# EAGLE design MidiExpansion (EAGLE 9.6.2)
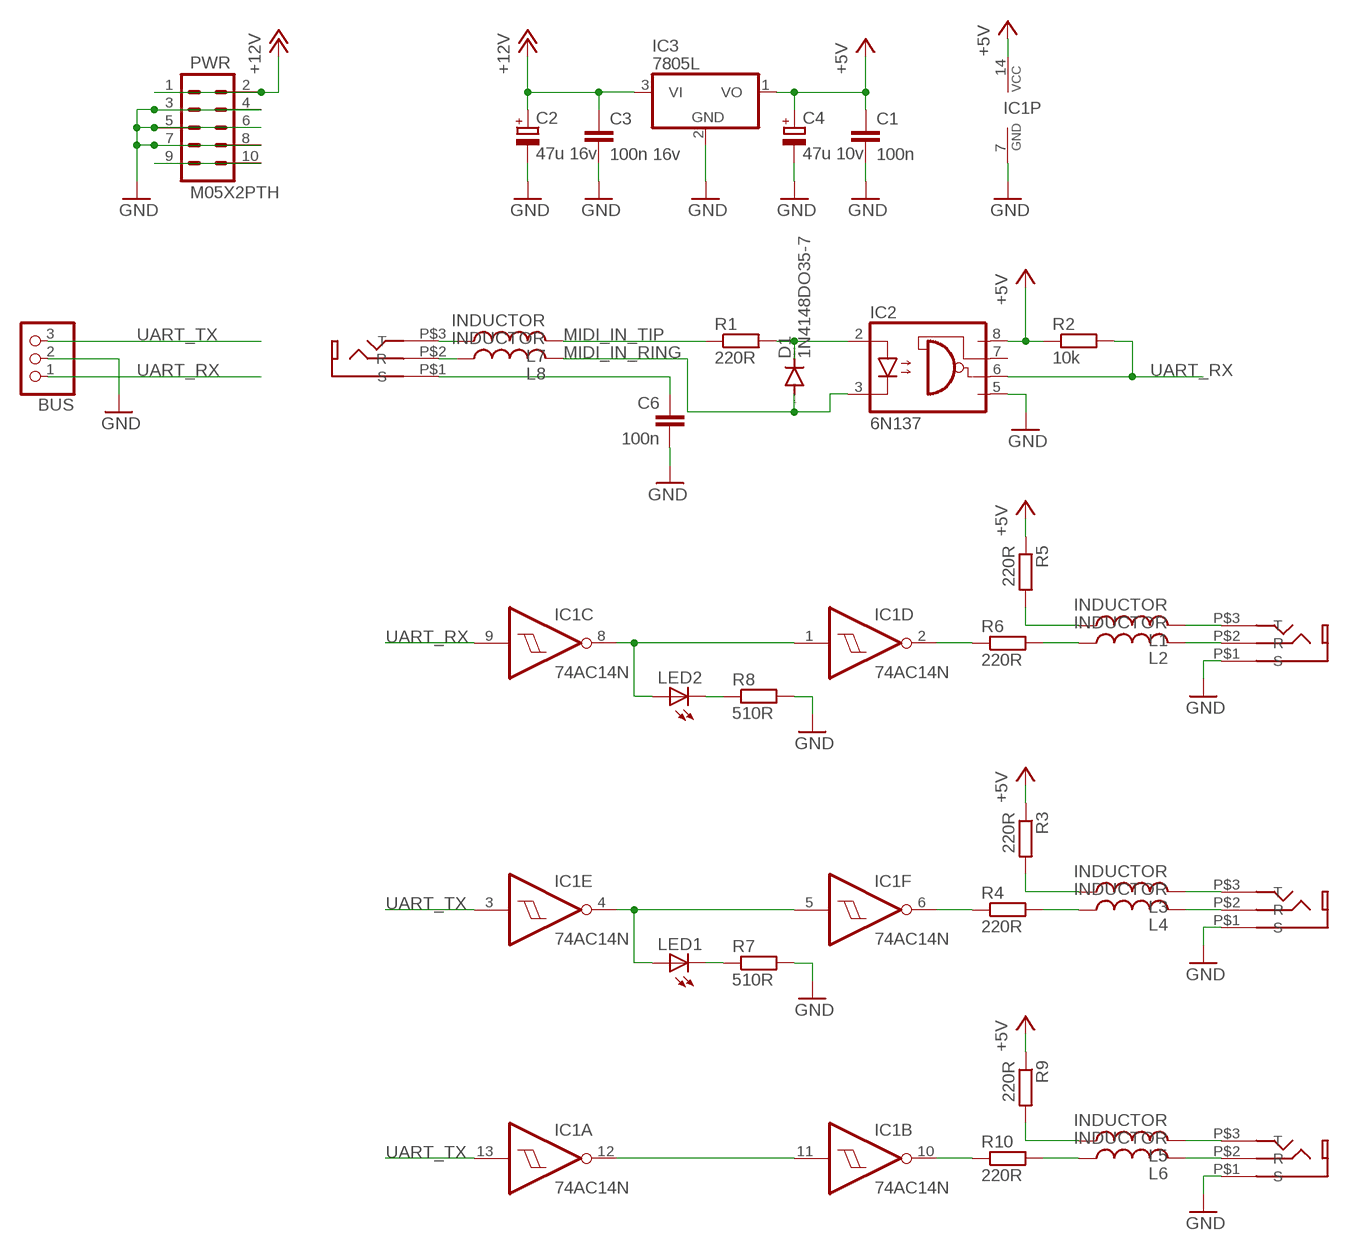
[diagram p0: schematic, sheet 1]

## Parts
BUS  CON-JST-1X03PH-TH  [JST-B3B-PH-KL]
C1  100n  C-EU050-024X044  [C050-024X044]
C2  47u 16v  CPOL-EUE5-6  [E5-6]
C3  100n 16v  C-EU050-024X044  [C050-024X044]
C4  47u 10v  CPOL-EUE5-6  [E5-6]
C6  100n  C-EU050-024X044  [C050-024X044]
D1  1N4148DO35-7  [DO35-7]
IC1  74AC14N  [DIL14]
IC2  6N137  [DIL08]
IC3  7805L  [TO92]
L1  INDUCTOR  [0603]
L2  INDUCTOR  [0603]
L3  INDUCTOR  [0603]
L4  INDUCTOR  [0603]
L5  INDUCTOR  [0603]
L6  INDUCTOR  [0603]
L7  INDUCTOR  [0603]
L8  INDUCTOR  [0603]
LED1  LED3MM  [LED3MM]
LED2  LED3MM  [LED3MM]
MIDI_IN  THONKICONN_STEREO  [THONKICONN_STEREO]
MIDI_OUT  THONKICONN_STEREO  [THONKICONN_STEREO]
MIDI_OUT1  THONKICONN_STEREO  [THONKICONN_STEREO]
MIDI_THRU  THONKICONN_STEREO  [THONKICONN_STEREO]
PWR  M05X2PTH  [AVR_ICSP]
R1  220R  R-EU_0204/7  [0204/7]
R2  10k  R-EU_0204/7  [0204/7]
R3  220R  R-EU_0204/7  [0204/7]
R4  220R  R-EU_0204/7  [0204/7]
R5  220R  R-EU_0204/7  [0204/7]
R6  220R  R-EU_0204/7  [0204/7]
R7  510R  R-EU_0204/7  [0204/7]
R8  510R  R-EU_0204/7  [0204/7]
R9  220R  R-EU_0204/7  [0204/7]
R10  220R  R-EU_0204/7  [0204/7]

## Nets
+5V: C1.1 C4.+ IC1.14(P:VCC) IC2.8(VCC) IC3.1(VO) R2.1 R3.1 R5.1 R9.1
+12V: C2.+ C3.1 IC3.3(VI) PWR.1 PWR.2
GND: BUS.2 C1.2 C2.- C3.2 C4.- C6.2 IC1.7(P:GND) IC2.5(GND) IC3.2(GND) MIDI_OUT1.P$1(S) MIDI_OUT.P$1(S) MIDI_THRU.P$1(S) PWR.3 PWR.4 PWR.5 PWR.6 PWR.7 PWR.8 R7.2 R8.2
MIDI_IN_RING: D1.A IC2.3(C) L8.2
MIDI_IN_TIP: L7.2 R1.1
MIDI_OUT_TIP: L3.1 R3.2
MIDI_OUT_TIP1: L1.1 R5.2
MIDI_OUT_TIP2: L5.1 R9.2
N$1: D1.C IC2.2(A) R1.2
N$2: C6.1 MIDI_IN.P$1(S)
N$3: L2.2 MIDI_THRU.P$2(R)
N$4: IC1.6(F:O) R4.1
N$5: L4.2 MIDI_OUT.P$2(R)
N$6: IC1.4(E:O) IC1.5(F:I) LED1.A
N$7: PWR.9 PWR.10
N$8: IC1.2(D:O) R6.1
N$9: IC1.11(B:I) IC1.12(A:O)
N$10: IC1.1(D:I) IC1.8(C:O) LED2.A
N$11: L6.2 MIDI_OUT1.P$2(R)
N$12: IC1.10(B:O) R10.1
N$13: LED1.K(C) R7.1
N$14: LED2.K(C) R8.1
N$15: L1.2 MIDI_THRU.P$3(T)
N$17: L2.1 R6.2
N$18: L3.2 MIDI_OUT.P$3(T)
N$19: L4.1 R4.2
N$20: L5.2 MIDI_OUT1.P$3(T)
N$21: L6.1 R10.2
N$25: L7.1 MIDI_IN.P$3(T)
N$26: L8.1 MIDI_IN.P$2(R)
UART_RX: BUS.1 IC1.9(C:I) IC2.6(VO) R2.2
UART_TX: BUS.3 IC1.3(E:I) IC1.13(A:I)
Unconnected: IC2.7(VE)

## Library data of the parts
BUS = Rebel:CON-JST-1X03
C1 C3 C6 = Rebel:C-EU: CAPACITOR, European symbol
C2 C4 = Rebel:CPOL-EU: POLARIZED CAPACITOR, European symbol
D1 = diode:1N4148: DIODE high speed (Philips)
IC1 = 74xx-eu:74*14: Hex schmitt trigger INVERTER
IC2 = optocoupler:6N137: MOTOROLA OPTO COUPLER; MPN: 6N137; OC_FARNELL: 1328376; OC_NEWARK: 52M1895
IC3 = linear:78*: Positive VOLTAGE REGULATOR Source: http://cache.national.com/ds/LM/LM78L05.pdf http://www.fairchildsemi.com/ds/LM/LM7805.pdf
L1-L8 = Rebel:INDUCTOR
LED1 LED2 = Rebel:LED: LED
MIDI_IN MIDI_OUT MIDI_OUT1 MIDI_THRU = Rebel:THONKICONN_STEREO
PWR = SparkFun:M05X2: Header 5x2 Standard 10-pin dual row 0.1" header. Commonly used with AVR-ISP. Use with Spark Fun Electronics SKU: PRT-00778
R1-R10 = Rebel:R-EU_: RESISTOR, European symbol

## Net classes
1 power: width 0.178 mm, drill 0.305 mm, clearance 0.178 mm to class 0, clearance 0.178 mm

## Board
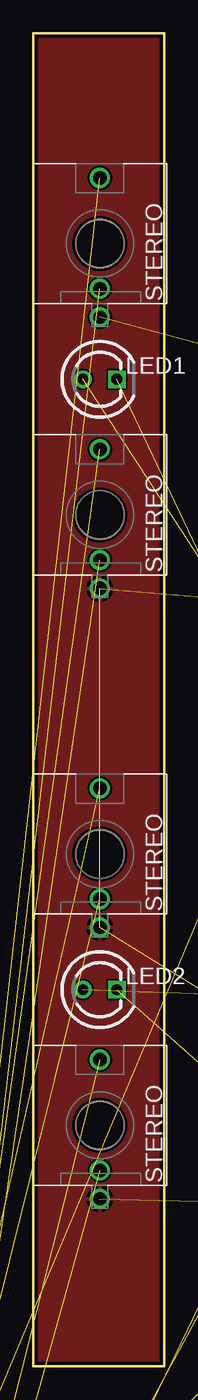
[diagram p1: board, top side]
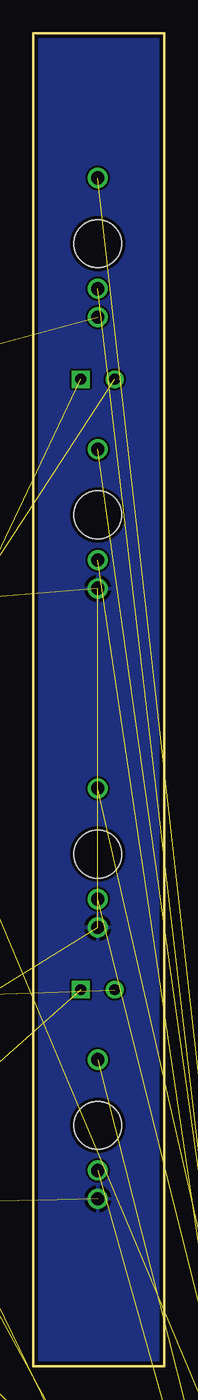
[diagram p2: board, bottom side, seen from below]

Size 9.8 x 99.82 mm. Coordinates in mm from the lower left corner, seen from the top.
Outline: 9.8,99.82 0,99.82 0,0 9.8,0 9.8,99.82
Copper layers (1*16): Top 0.035mm / dielectric 1.5mm / Bottom 0.035mm
Design rules "SeeedStudio_2layer_DRU_no_angle_20140221": minimum track width 6mil, minimum drill 12mil, track to track 6mil, track to pad 6mil, pad to pad 6mil, via to via 6mil, smd to smd 0mil, copper to edge 10mil, drill to drill 10mil, minimum pad ring 10mil, minimum via ring 6mil, stop-mask expansion 2mil, vias tented up to drill 100mil, thermal gap 10mil

### Footprints (pad centres in the part's own frame; a part is rotated, then mirrored left to right if it is on the bottom)
JST-B3B-PH-KL = drill 0.8 pad 1.422: 1 2,0; 2 0,0; 3 -2,0
C050-024X044 = drill 0.813 octagon: 1 -2.54,0; 2 2.54,0
E5-6 = drill 0.813 pad 1.905: + -2.54,0 | drill 0.813 pad 1.905 octagon: - 2.54,0
DO35-7 = drill 0.813 long: A 3.81,0; C -3.81,0
DIL14 = drill 0.813 long: 1 -7.62,-3.81; 2 -5.08,-3.81; 3 -2.54,-3.81; 4 0,-3.81; 5 2.54,-3.81; 6 5.08,-3.81; 7 7.62,-3.81; 8 7.62,3.81; 9 5.08,3.81; 10 2.54,3.81; 11 0,3.81; 12 -2.54,3.81; 13 -5.08,3.81; 14 -7.62,3.81
DIL08 = drill 0.813 offset: 1 -3.81,-3.81; 2 -1.27,-3.81; 3 1.27,-3.81; 4 3.81,-3.81; 5 3.81,3.81; 6 1.27,3.81; 7 -1.27,3.81; 8 -3.81,3.81
TO92 = drill 0.813 octagon: 1 -1.27,0; 2 0,1.905; 3 1.27,0
0603 = smd 1.1 x 1: 1 -0.85,0; 2 0.85,0
LED3MM = drill 0.813: A -1.27,0 | drill 0.813 square: K 1.27,0
THONKICONN_STEREO = drill 1: P$1 0,-5.5; P$2 0,-3.38; P$3 0,4.92 | hole 3.6: 0,0
AVR_ICSP = drill 1.016 pad 1.88 octagon: 1 -1.27,5.08; 2 1.27,5.08; 3 -1.27,2.54; 4 1.27,2.54; 5 -1.27,0; 6 1.27,0; 7 -1.27,-2.54; 8 1.27,-2.54; 9 -1.27,-5.08; 10 1.27,-5.08
0204/7 = drill 0.813: 1 -3.81,0; 2 3.81,0

### Placement (x,y rotation side)
BUS  44.35,100.58 0 top  (outside the outline)
C1  25.3,95.5 270 top  (outside the outline)
C2  41.81,48.51 0 top  (outside the outline)
C3  55.78,51.05 0 top  (outside the outline)
C4  31.65,94.23 180 top  (outside the outline)
C6  50.7,68.83 90 top  (outside the outline)
D1  22.76,89.15 270 top  (outside the outline)
IC1  43.08,19.3 270 top  (outside the outline)
IC2  41.81,58.67 270 top  (outside the outline)
IC3  51.97,94.23 0 top  (outside the outline)
L1  -7.72,-8.64 0 top  (outside the outline)
L2  -7.72,-12.45 0 top  (outside the outline)
L3  -7.72,-16.26 0 top  (outside the outline)
L4  -7.72,-20.07 0 top  (outside the outline)
L5  -7.72,-23.88 0 top  (outside the outline)
L6  -7.72,-27.69 0 top  (outside the outline)
L7  -7.72,-31.5 0 top  (outside the outline)
L8  -7.72,-35.31 0 top  (outside the outline)
LED1  4.98,73.91 0 top
LED2  4.98,28.19 0 top
MIDI_IN  4.98,84.07 0 top
MIDI_OUT  4.98,63.75 0 top
MIDI_OUT1  4.98,18.03 0 top
MIDI_THRU  4.98,38.35 0 top
PWR  43.08,91.69 0 top  (outside the outline)
R1  41.81,65.02 180 top  (outside the outline)
R2  49.43,58.67 270 top  (outside the outline)
R3  30.38,80.26 270 top  (outside the outline)
R4  55.78,28.19 270 top  (outside the outline)
R5  44.35,5.33 0 top  (outside the outline)
R6  54.51,5.33 0 top  (outside the outline)
R7  44.35,1.52 0 top  (outside the outline)
R8  44.35,-2.29 0 top  (outside the outline)
R9  55.78,47.24 0 top  (outside the outline)
R10  55.78,43.43 0 top  (outside the outline)

### Tracks (layer width: path | path; a pad name or v marks a point on that pad's centre or on a via)
+5V  (8 unrouted)
+12V  (4 unrouted)
GND  (19 unrouted)
  pour Top: -1.74,100.82 -1.74,-0.18 30.5,-0.18 30.55,100.88
  pour Bottom: -1.74,100.82 -1.74,-0.18 31.77,-0.18 31.82,100.88
MIDI_IN_RING  (2 unrouted)
MIDI_IN_TIP  (1 unrouted)
MIDI_OUT_TIP  (1 unrouted)
MIDI_OUT_TIP1  (1 unrouted)
MIDI_OUT_TIP2  (1 unrouted)
N$1  (2 unrouted)
N$2  (1 unrouted)
N$3  (1 unrouted)
N$4  (1 unrouted)
N$5  (1 unrouted)
N$6  (2 unrouted)
N$7  (1 unrouted)
N$8  (1 unrouted)
N$9  (1 unrouted)
N$10  (2 unrouted)
N$11  (1 unrouted)
N$12  (1 unrouted)
N$13  (1 unrouted)
N$14  (1 unrouted)
N$15  (1 unrouted)
N$17  (1 unrouted)
N$18  (1 unrouted)
N$19  (1 unrouted)
N$20  (1 unrouted)
N$21  (1 unrouted)
N$25  (1 unrouted)
N$26  (1 unrouted)
UART_RX  (3 unrouted)
UART_TX  (2 unrouted)